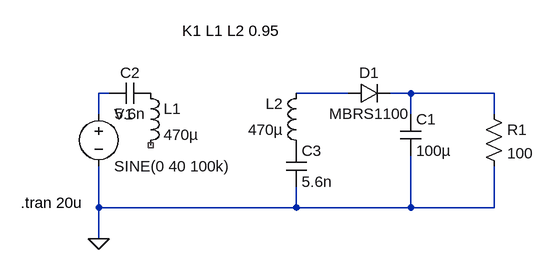
[diagram p0: schematic inductive power charing something.asc]
inductive power charing something.asc, the LTspice schematic file:
Version 4.1
SHEET 1 880 680
WIRE 16 80 0 80
WIRE 384 80 304 80
WIRE 480 80 448 80
WIRE 608 80 480 80
WIRE 0 112 0 80
WIRE 480 112 480 80
WIRE 608 112 608 80
WIRE 0 256 0 192
WIRE 304 256 304 224
WIRE 304 256 0 256
WIRE 480 256 480 176
WIRE 480 256 304 256
WIRE 608 256 608 192
WIRE 608 256 480 256
WIRE 0 304 0 256
FLAG 0 304 0
SYMBOL voltage 0 96 R0
WINDOW 123 0 0 Left 0
WINDOW 39 0 0 Left 0
SYMATTR InstName V1
SYMATTR Value SINE(0 40 100k)
SYMBOL diode 384 96 R270
WINDOW 0 32 32 VTop 2
WINDOW 3 0 32 VBottom 2
SYMATTR InstName D1
SYMATTR Value MBRS1100
SYMATTR Description Diode
SYMATTR Type diode
SYMBOL cap 464 112 R0
SYMATTR InstName C1
SYMATTR Value 100µ
SYMBOL res 592 96 R0
SYMATTR InstName R1
SYMATTR Value 100
SYMBOL cap 80 64 R90
WINDOW 0 0 32 VBottom 2
WINDOW 3 32 32 VTop 2
SYMATTR InstName C2
SYMATTR Value 5.6n
SYMBOL ind 64 64 R0
SYMATTR InstName L1
SYMATTR Value 470µ
SYMATTR Type ind
SYMATTR SpiceLine Rser=1m
SYMBOL ind 320 176 R180
WINDOW 0 36 80 Left 2
WINDOW 3 36 40 Left 2
SYMATTR InstName L2
SYMATTR Value 470µ
SYMATTR Type ind
SYMATTR SpiceLine Rser=1m
SYMBOL cap 288 160 R0
SYMATTR InstName C3
SYMATTR Value 5.6n
TEXT 128 -16 Left 2 !K1 L1 L2 0.95
TEXT -120 248 Left 2 !.tran 20u

The netlist it stands for:
* inductive power charing something.asc
V1 N001 0 SINE(0 40 100k)
D1 N002 N003 MBRS1100
C1 N003 0 100µ
R1 N003 0 100
C2 P001 N001 5.6n
L1 P001 NC_01 470µ Rser=1m
L2 P002 N002 470µ Rser=1m
C3 P002 0 5.6n
.model D D
.lib standard.dio
K1 L1 L2 0.95
.tran 20u
.backanno
.end